# EAGLE design 7segement4digits1badidea-max7219-smd-mk-4.0 (EAGLE 6.5.0)
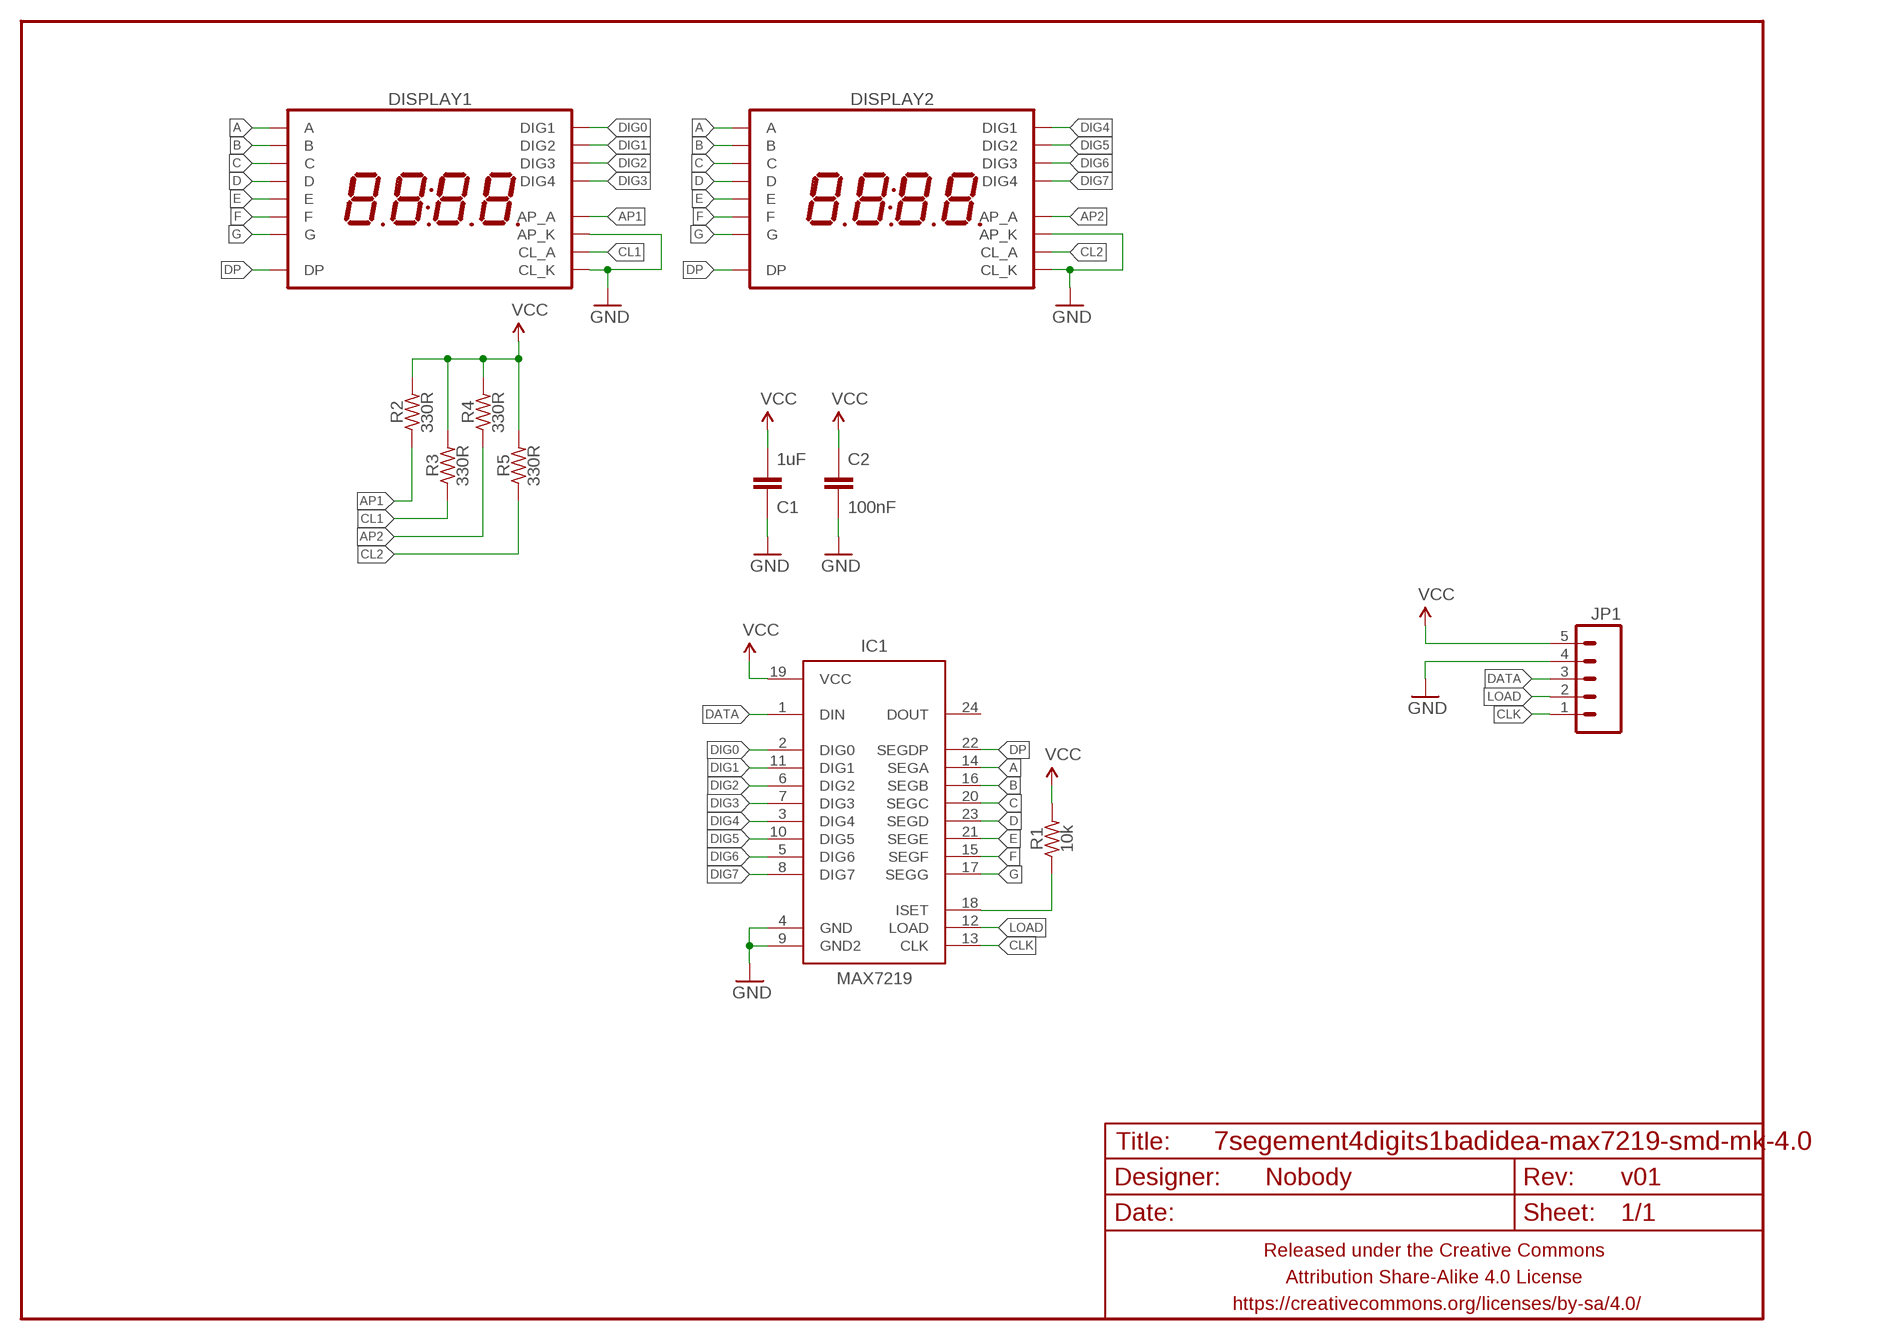
[diagram p0: schematic, sheet 1]

## Parts
C1  1uF  CAPACITOR-CERAMICC0805  [C0805]
C2  100nF  CAPACITOR-CERAMICC0805  [C0805]
DISPLAY1  7SEG_4DIGIT_COLON_APOS  [7SEG_4DIG_10MM]
DISPLAY2  7SEG_4DIGIT_COLON_APOS  [7SEG_4DIG_10MM]
FRAME1  FRAME-LETTERNO_PACKAGE  [DUMMY]
IC1  MAX7219  MAX7219SOIC-W  [SO24W]
JP1  M05PTH  [1X05]
R1  10k  RESISTORR0805  [R0805]
R2  330R  RESISTORR0805  [R0805]
R3  330R  RESISTORR0805  [R0805]
R4  330R  RESISTORR0805  [R0805]
R5  330R  RESISTORR0805  [R0805]

## Nets
A: DISPLAY1.14(A) DISPLAY2.14(A) IC1.14(SEGA)
AP1: DISPLAY1.10(AP_A) R2.1
AP2: DISPLAY2.10(AP_A) R4.1
B: DISPLAY1.16(B) DISPLAY2.16(B) IC1.16(SEGB)
C: DISPLAY1.13(C) DISPLAY2.13(C) IC1.20(SEGC)
CL1: DISPLAY1.4(CL_A) R3.1
CL2: DISPLAY2.4(CL_A) R5.1
CLK: IC1.13(CLK) JP1.1
D: DISPLAY1.3(D) DISPLAY2.3(D) IC1.23(SEGD)
DATA: IC1.1(DIN) JP1.3
DIG0: DISPLAY1.1(DIG1) IC1.2(DIG0)
DIG1: DISPLAY1.2(DIG2) IC1.11(DIG1)
DIG2: DISPLAY1.6(DIG3) IC1.6(DIG2)
DIG3: DISPLAY1.8(DIG4) IC1.7(DIG3)
DIG4: DISPLAY2.1(DIG1) IC1.3(DIG4)
DIG5: DISPLAY2.2(DIG2) IC1.10(DIG5)
DIG6: DISPLAY2.6(DIG3) IC1.5(DIG6)
DIG7: DISPLAY2.8(DIG4) IC1.8(DIG7)
DP: DISPLAY1.7(DP) DISPLAY2.7(DP) IC1.22(SEGDP)
E: DISPLAY1.5(E) DISPLAY2.5(E) IC1.21(SEGE)
F: DISPLAY1.11(F) DISPLAY2.11(F) IC1.15(SEGF)
G: DISPLAY1.15(G) DISPLAY2.15(G) IC1.17(SEGG)
GND: C1.1 C2.2 DISPLAY1.9(AP_K) DISPLAY1.12(CL_K) DISPLAY2.9(AP_K) DISPLAY2.12(CL_K) IC1.4(GND) IC1.9(GND2) JP1.4
LOAD: IC1.12(LOAD) JP1.2
N$1: IC1.18(ISET) R1.1
VCC: C1.2 C2.1 IC1.19(VCC) JP1.5 R1.2 R2.2 R3.2 R4.2 R5.2
Unconnected: IC1.24(DOUT)

## Library data of the parts
C1 C2 = A_butts:CAPACITOR-CERAMIC: CAPACITOR, European symbol
DISPLAY1 DISPLAY2 = A_butts:7SEG_4DIGIT_COLON_APOS
FRAME1 = A_butts:FRAME-LETTER: Schematic Frame Standard 8.5x11 US Letter frame; DESIGNER: Nobody; VERSION: v01
IC1 = A_butts:MAX7219: 8-digit, 8-segment LED display driver, serial input
JP1 = A_butts:M05: Header 5 Standard 5-pin 0.1" header. Use with straight break away headers (SKU : PRT-00116), right angle break away headers (PRT-00553), swiss pins (PRT-00743), machine pins (PRT-00117), and female headers (PRT-00115). Molex polarized connector foot print use with SKU : PRT-08230 with associated crimp pins and housings.
R1-R5 = A_butts:RESISTOR: RESISTOR, American symbol

## Board
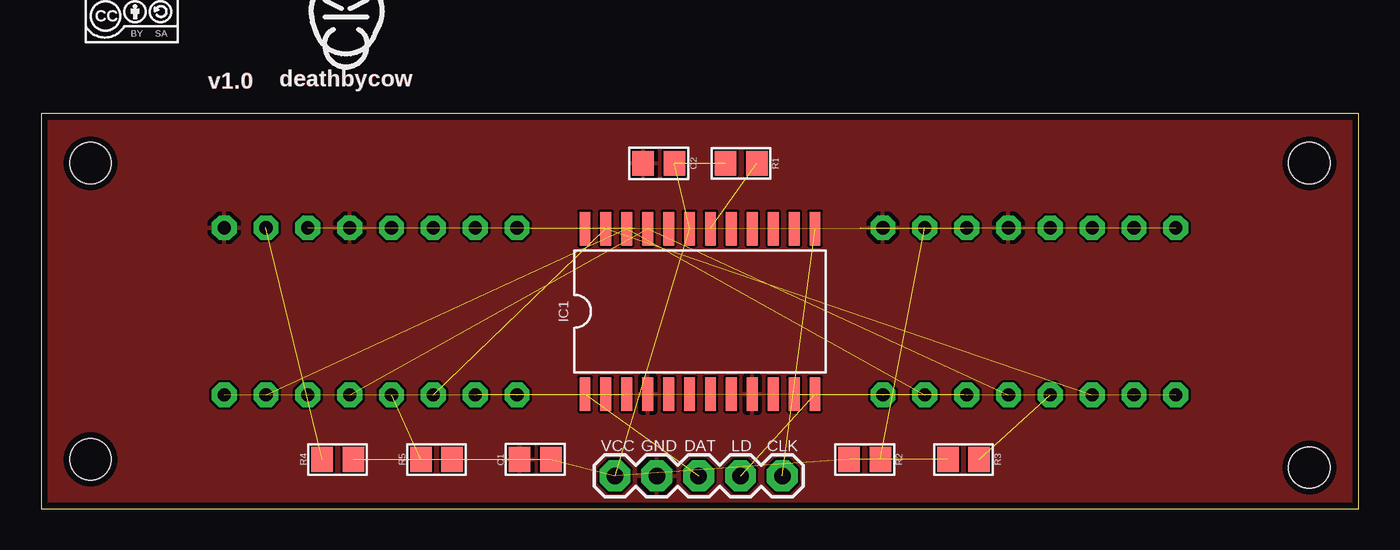
[diagram p1: board, top side]
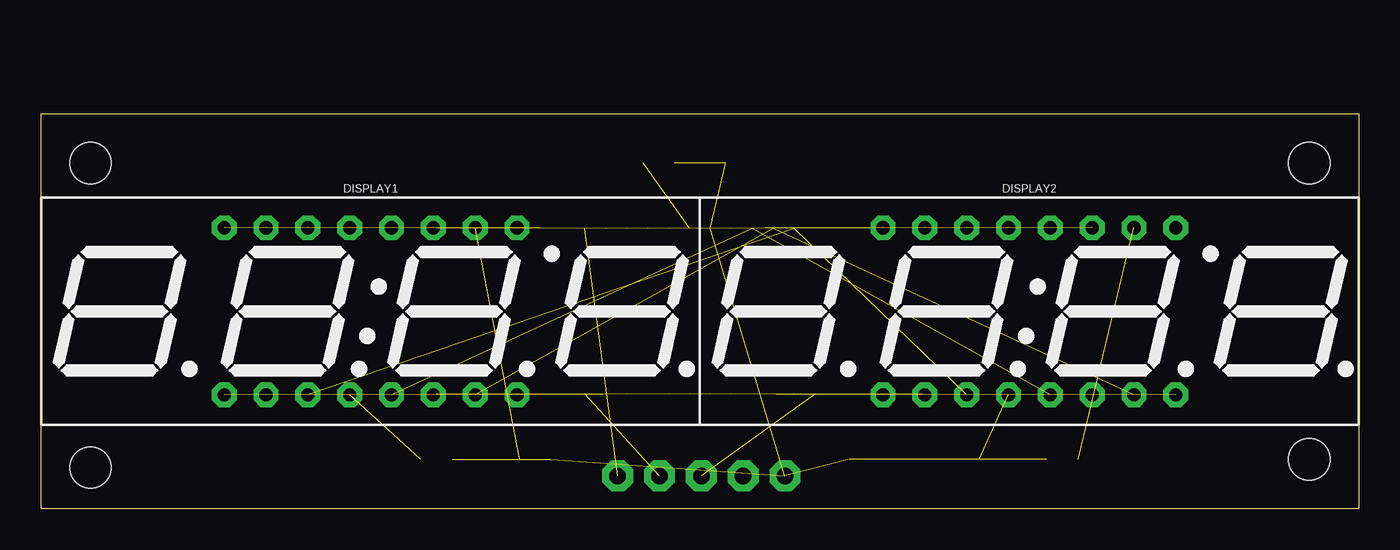
[diagram p2: board, bottom side, seen from below]

Size 80 x 24 mm. Coordinates in mm from the lower left corner, seen from the top.
Outline: 80,0 80,24 0,24 0,0 80,0
Copper layers (1*16): Top 0.0356mm / dielectric 1.5011mm / Bottom 0.0356mm
Design rules "LaenPCBOrder2": minimum track width 6mil, minimum drill 13mil, track to track 6mil, track to pad 6mil, pad to pad 6mil, via to via 6mil, smd to smd 6mil, copper to edge 15mil, drill to drill 6mil, minimum pad ring 7mil, minimum via ring 7mil, stop-mask expansion 3mil, vias tented up to drill 20mil, thermal gap 10mil
Holes 2.5 mm at 3,21 3,3 77,2.5 77,21

### Footprints (pad centres in the part's own frame; a part is rotated, then mirrored left to right if it is on the bottom)
C0805 = smd 1.3 x 1.5: 1 -0.95,0; 2 0.95,0
7SEG_4DIG_10MM = drill 0.8 pad 1.5 octagon: 1 -8.89,-5.08; 2 -6.35,-5.08; 3 -3.81,-5.08; 4 -1.27,-5.08; 5 1.27,-5.08; 6 3.81,-5.08; 7 6.35,-5.08; 8 8.89,-5.08; 9 8.89,5.08; 10 6.35,5.08; 11 3.81,5.08; 12 1.27,5.08; 13 -1.27,5.08; 14 -3.81,5.08; 15 -6.35,5.08; 16 -8.89,5.08
SO24W = smd 0.66 x 2.032: 1 -6.985,-5.029; 2 -5.715,-5.029; 3 -4.445,-5.029; 4 -3.175,-5.029; 5 -1.905,-5.029; 6 -0.635,-5.029; 7 0.635,-5.029; 8 1.905,-5.029; 9 3.175,-5.029; 10 4.445,-5.029; 11 5.715,-5.029; 12 6.985,-5.029; 13 6.985,5.029; 14 5.715,5.029; 15 4.445,5.029; 16 3.175,5.029; 17 1.905,5.029; 18 0.635,5.029; 19 -0.635,5.029; 20 -1.905,5.029; 21 -3.175,5.029; 22 -4.445,5.029; 23 -5.715,5.029; 24 -6.985,5.029
1X05 = drill 1 pad 1.88 octagon: 1 0,0; 2 2.54,0; 3 5.08,0; 4 7.62,0; 5 10.16,0
R0805 = smd 1.3 x 1.5: 1 -0.95,0; 2 0.95,0

### Placement (x,y rotation side)
C1  30,3 0 top
C2  37.5,21 180 top
DISPLAY1  60,12 0 bottom
DISPLAY2  20,12 0 bottom
FRAME1  0,0 0 top
IC1  40,12 0 top
JP1  45,2 180 top
R1  42.5,21 180 top
R2  50,3 180 top
R3  56,3 180 top
R4  18,3 0 top
R5  24,3 0 top
U$1  [CC-BY-SA-4.0-NO-URL]  5.5,29.75 0 top  (outside the outline)
U$2  [COW_SMALL_METAL]  18.5,30.4 0 top  (outside the outline)
U$3  [OSHWLOGO_TOP_0.2_A]  5.5,34 0 top  (outside the outline)

### Tracks (layer width: path | path; a pad name or v marks a point on that pad's centre or on a via)
A  (2 unrouted)
AP1  (1 unrouted)
AP2  (1 unrouted)
B  (2 unrouted)
C  (2 unrouted)
CL1  (1 unrouted)
CL2  (1 unrouted)
CLK  (1 unrouted)
D  (2 unrouted)
DATA  (1 unrouted)
DIG0  (1 unrouted)
DIG1  (1 unrouted)
DIG2  (1 unrouted)
DIG3  (1 unrouted)
DIG4  (1 unrouted)
DIG5  (1 unrouted)
DIG6  (1 unrouted)
DIG7  (1 unrouted)
DP  (2 unrouted)
E  (2 unrouted)
F  (2 unrouted)
G  (2 unrouted)
GND
  pour Top: -0.1,24.1 80.1,24.1 80.1,-0.1 -0.1,-0.1
LOAD  (1 unrouted)
N$1  (1 unrouted)
VCC  (8 unrouted)

### Text on the board
Top: 7 Segments | 4 Digits | 0x1BAD1DEA | MAX7219 Breakout
tPlace: 7 Segments | 4 Digits | 0x1BAD1DEA | MAX7219 Breakout | VCC | GND | DAT | LD | CLK